# Altium schematic sheet single-phase_bridge_test1.SchDoc
size A3
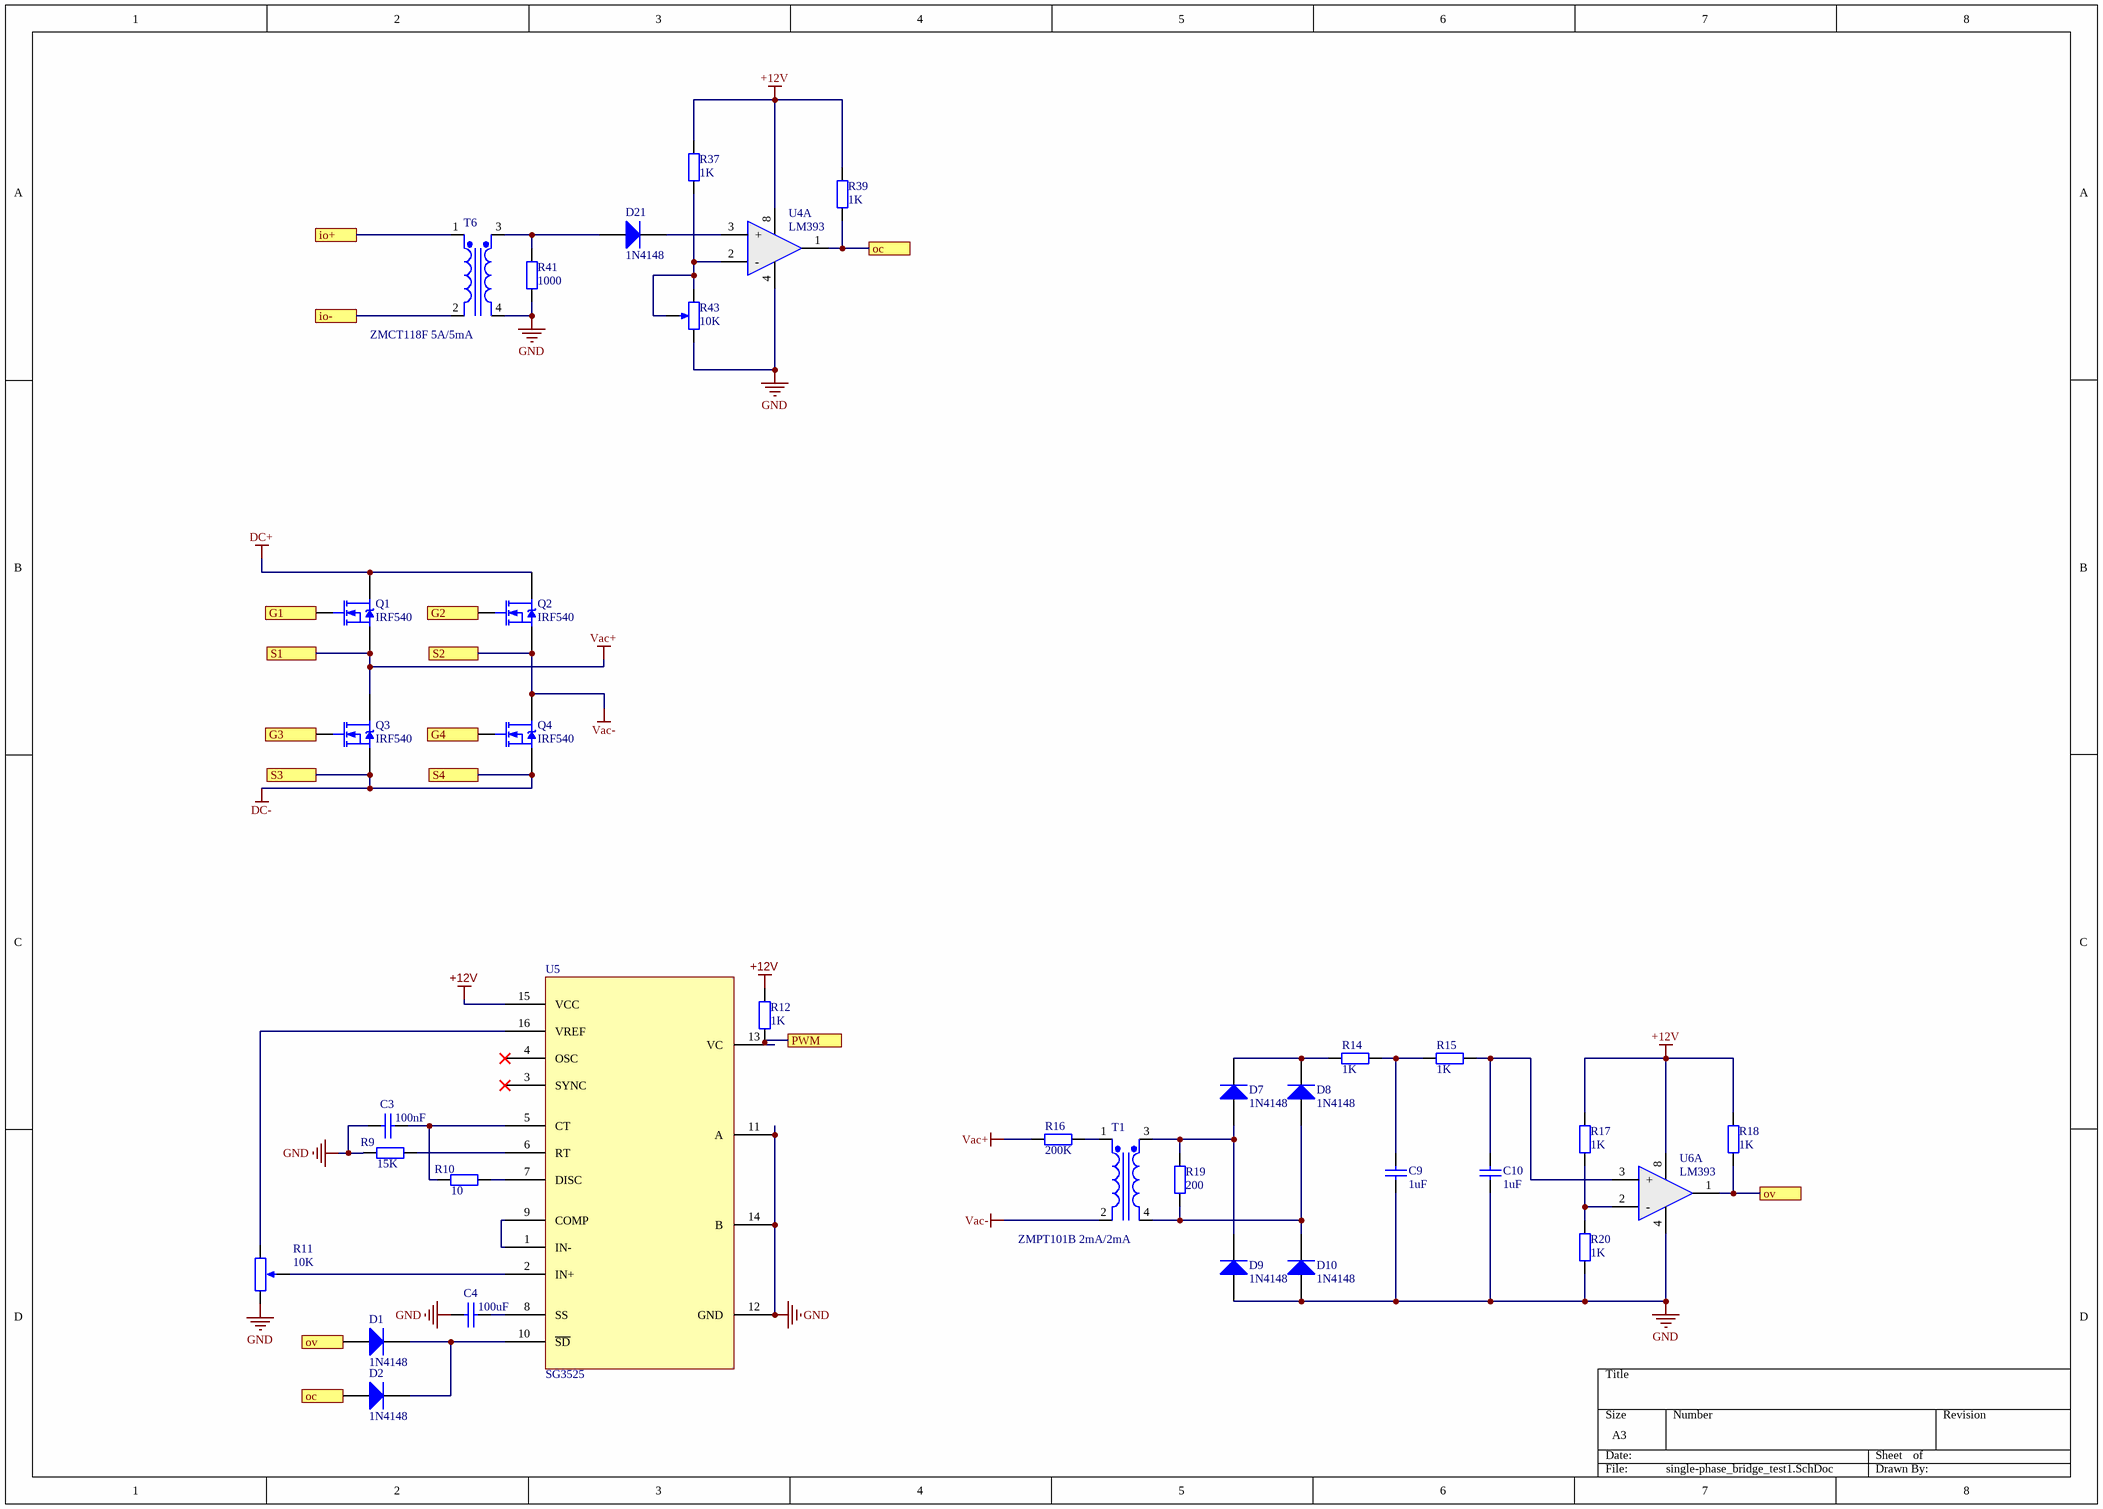
[diagram p0: single-phase_bridge_test1.SchDoc]

## Parts
C3  100nF  [C0603]
C4  100uF  [C0603]
C9  value 1uF  [0805C]  (hidden comment: Cap)
C10  value 1uF  [0805C]  (hidden comment: Cap)
D1  Type: 1N4148  [DIODE-SMA]  (hidden comment: Diode)
D2  Type: 1N4148  [DIODE-SMA]  (hidden comment: Diode)
D7  Type: 1N4148  [DIODE-SMA]  (hidden comment: Diode)
D8  Type: 1N4148  [DIODE-SMA]  (hidden comment: Diode)
D9  Type: 1N4148  [DIODE-SMA]  (hidden comment: Diode)
D10  Type: 1N4148  [DIODE-SMA]  (hidden comment: Diode)
D21  Type: 1N4148  [DIODE-SMA]  (hidden comment: Diode)
Q1  IRF540  [TO-220]
Q2  IRF540  [TO-220]
Q3  IRF540  [TO-220]
Q4  IRF540  [TO-220]
R9  value 15K  [R0805_3D]  (hidden comment: Res)
R10  value 10  [R0805_3D]  (hidden comment: Res)
R11  value 10K  [RPOT]  (hidden comment: RPot)
R12  value 1K  [R0805_3D]  (hidden comment: Res)
R14  value 1K  [0805R]  (hidden comment: Res2)
R15  value 1K  [0805R]  (hidden comment: Res2)
R16  value 200K  [0805R]  (hidden comment: Res2)
R17  1K  [0805R]
R18  1K  [0805R]
R19  value 200  [0805R]  (hidden comment: Res2)
R20  1K  [0805R]
R37  1K  [0805R]
R39  1K  [0805R]
R41  value 1000  [0805R]  (hidden comment: Res2)
R43  10K  [RPot_3296W]
T1  ZMPT101B 2mA/2mA  [PT ZMPT101B]
T6  ZMCT118F 5A/5mA  [PT ZMPT101B]
U4  LM393  [DIP8]  (part A of 2)
U5  SG3525
U6  LM393  [DIP8]  (part A of 2)

## Ports
G1, G2, G3, G4, io+, io-, oc, ov, PWM, S1, S2, S3, S4

## Nets
+12V: R12.2 R17.2 R18.2 R37.2 R39.2 U4.8(V-) U5.15(VCC) U6.8(V-)
DC+: Q1.2(D) Q2.2(D)
DC-: Q3.3(S) Q4.3(S) ; port S3, port S4
GND: C3.1 C4.1 C9.1 C10.1 D9.1(A) D10.1(A) R9.1 R11.1(TOP) R20.1 R41.1 R43.1(TOP) T6.4(Sec-) U4.4(V+) U5.11(A) U5.12(GND) U5.14(B) U6.4(V+)
Vac+: Q1.3(S) Q3.2(D) R16.1 ; port S1
Vac-: Q2.3(S) Q4.2(D) T1.2(Pri-) ; port S2
G1: Q1.1(G) ; port G1
G2: Q2.1(G) ; port G2
G3: Q3.1(G) ; port G3
G4: Q4.1(G) ; port G4
io+: T6.1(Pri+) ; port io+
io-: T6.2(Pri-) ; port io-
oc: D2.1(A) R39.1 U4.1(OUT) ; port oc
ov: D1.1(A) R18.1 U6.1(OUT) ; port ov
PWM: R12.1 U5.13(VC) ; port PWM
NetC3_2: C3.2 R10.1 U5.5(CT)
NetC4_2: C4.2 U5.8(SS)
NetC9_2: C9.2 R14.1 R15.2
NetC10_2: C10.2 R15.1 U6.3(+)
NetD1_2: D1.2(K) D2.2(K) U5.10(~{SD})
NetD7_1: D7.1(A) D9.2(K) R19.2 T1.3(Sec+)
NetD7_2: D7.2(K) D8.2(K) R14.2
NetD8_1: D8.1(A) D10.2(K) R19.1 T1.4(Sec-)
NetD21_1: D21.1(A) R41.2 T6.3(Sec+)
NetD21_2: D21.2(K) U4.3(+)
NetR9_2: R9.2 U5.6(RT)
NetR10_2: R10.2 U5.7(DISC)
NetR11_2: R11.2(TAP) U5.2(IN+)
NetR11_3: R11.3(BOT) U5.16(VREF)
NetR16_2: R16.2 T1.1(Pri+)
NetR17_1: R17.1 R20.2 U6.2(-)
NetR37_1: R37.1 R43.2(TAP) R43.3(BOT) U4.2(-)
NetU5_1: U5.1(IN-) U5.9(COMP)

Not connected (* = marked no-connect by the designer): U5 3(SYNC)* 4(OSC)*

## Library data of the parts
C3 C4 = Cap: Capacitor
C9 C10 = Cap: 无极性电容; Published: 8-Jun-2000; LatestRevisionDate: 17-Jul-2002; LatestRevisionNote: Re-released for DXP Platform.; PackageReference: RAD-0.3; Publisher: Altium Limited
D1 D2 D7-D10 D21 = Diode: 二极管; Published: 8-Jun-2000; LatestRevisionDate: 17-Jul-2002; LatestRevisionNote: Re-released for DXP Platform.; PackageDocument: Sep-1996; PackageReference: SMC; Publisher: Altium Limited; Code_JEDEC: DO-214-AB
Q1-Q4 = MOSFET-N: N-Channel MOSFET; PackageDocument: 1995/1996; Published: 8-Jun-2000; LatestRevisionDate: 17-Jul-2002; LatestRevisionNote: Re-released for DXP Platform.; PackageReference: E3; Publisher: Altium Limited
R9 R10 R12 = Res: 贴片电阻; Published: 8-Jun-2000; LatestRevisionDate: 17-Jul-2002; LatestRevisionNote: Re-released for DXP Platform.; PackageReference: AXIAL-0.4; Publisher: Altium Limited
R11 = RPot: 精密可调电阻; Sim Note: Enter the Resistance value and the set point into parameter fields.; Set Position: 0.5; Published: 8-Jun-2000; LatestRevisionDate: 17-Jul-2002; LatestRevisionNote: Re-released for DXP Platform.; PackageReference: VR5; Publisher: Altium Limited
R14-R16 R19 R41 = Res2: Resistor; Published: 8-Jun-2000; LatestRevisionDate: 17-Jul-2002; LatestRevisionNote: Re-released for DXP Platform.; PackageReference: AXIAL-0.4; Publisher: Altium Limited
R17 R18 R20 R37 R39 = Res: 电阻; Published: 8-Jun-2000; LatestRevisionDate: 17-Jul-2002; LatestRevisionNote: Re-released for DXP Platform.; PackageReference: AXIAL-0.4; Publisher: Altium Limited
R43 = RPot: 电位器; Sim Note: Enter the Resistance value and the set point into parameter fields.; Set Position: 0.5; Published: 8-Jun-2000; LatestRevisionDate: 17-Jul-2002; LatestRevisionNote: Re-released for DXP Platform.; PackageReference: VR5; Publisher: Altium Limited
T1 T6 = DL-PT202H1
U4 U6 = LM393: 2比较器芯片